# Altium schematic sheet [01] - TITLE SHEET.SchDoc: Title Sheet
size 431 x 279 mm; Address2: Company Address 1; Address3: Company Address 2; SheetNumber: 1; SheetTotal: 4
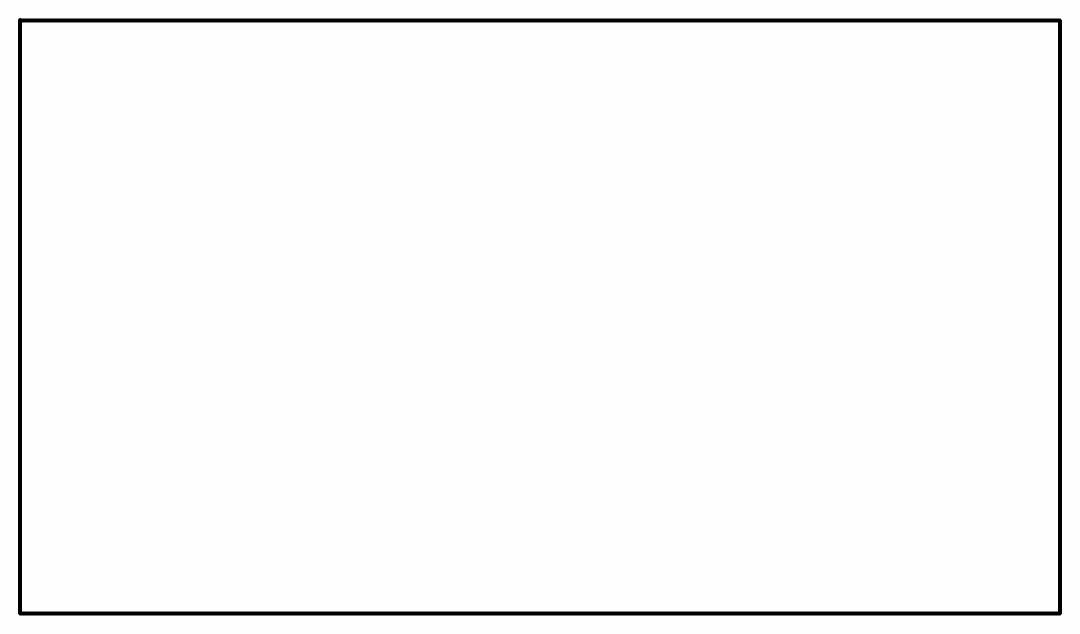
[diagram p0: [01] - TITLE SHEET.SchDoc]

## Sub-sheets
Table of Contents = [02] - TABLE OF CONTENTS.SchDoc: no entries

## Notes on the sheet
- Revision
- Description
- DOCUMENT REVISION HISTORY
- ECN
- Date
- Approved By
- CONFIDENTIALITY NOTICE. THIS DRAWING AND INFORMATION CONTAINED HEREIN ARE THE EXCLUSIVE PROPERTY OF [[COMPANY NAME]] NEITHER THIS DESIGN NOR ANY INFORMATION CONTAINED IN THIS DRAWING MAY BE REPRODUCED OR DISCLOSED WITHOUT THE EXPRESS WRITTEN CONSENT OF [[COMPANY NAME]].
- CHECKER:
- DESIGNER:
- ENGINEER:
- APPROVALS
- DATE
- TITLE:
- PCB Part Number:
- PCB Rev.:
- PCB Variant:
- Replaces PCB P/N & Rev.:
- ASSY DWG:
- FAB DWG:
- PCB DWG:
- REFERNCE DOCUMENTS
- SHEET TITLE:
- SIZE
- B
- Time Stamp:
- Doc. No.:
- Doc. Rev.:
- Doc. Status:
- BOM:
- Sheet
- of